# EAGLE design schema (EAGLE 6.5.0)
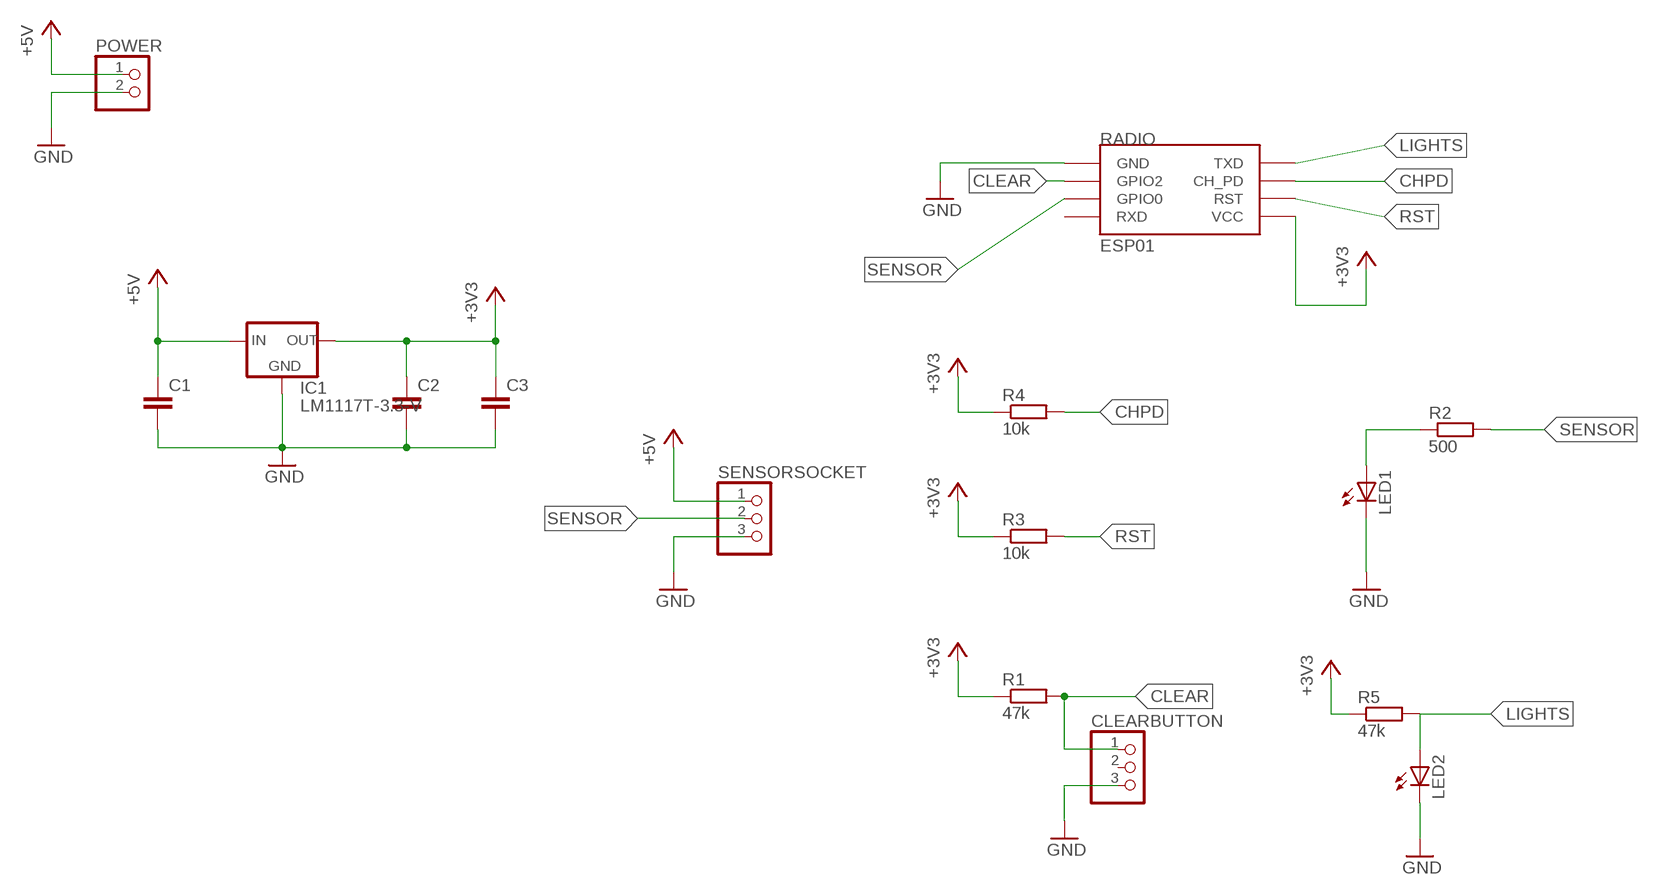
[diagram p0: schematic, sheet 1]

## Parts
C1  C-EU025-024X044  [C025-024X044]
C2  C-EU025-024X044  [C025-024X044]
C3  C-EU025-024X044  [C025-024X044]
CLEARBUTTON  PINHD-1X3  [1X03]
IC1  LM1117T-3.3-V  [TO220V]
LED1  LED3MM  [LED3MM]
LED2  LED3MM  [LED3MM]
POWER  PINHD-1X2  [1X02]
R1  47k  R-EU_0204/5  [0204/5]
R2  500  R-EU_0204/5  [0204/5]
R3  10k  R-EU_0204/5  [0204/5]
R4  10k  R-EU_0204/5  [0204/5]
R5  47k  R-EU_0204/5  [0204/5]
RADIO  ESP01  [ESP01]
SENSORSOCKET  PINHD-1X3  [1X03]

## Nets
+3V3: C2.1 C3.1 IC1.2(OUT) R1.1 R3.1 R4.1 R5.1 RADIO.VCC
+5V: C1.1 IC1.3(IN) POWER.1 SENSORSOCKET.1
CHPD: R4.2 RADIO.CH_PD
CLEAR: CLEARBUTTON.1 R1.2 RADIO.GPIO2
GND: C1.2 C2.2 C3.2 CLEARBUTTON.3 IC1.1(GND) LED1.K(C) LED2.K(C) POWER.2 RADIO.GND SENSORSOCKET.3
LIGHTS: LED2.A R5.2 RADIO.TX(TXD)
N$1: LED1.A R2.1
RST: R3.2 RADIO.RST
SENSOR: R2.2 RADIO.GPIO0 SENSORSOCKET.2
Unconnected: CLEARBUTTON.2 RADIO.RX(RXD)

## Library data of the parts
C1-C3 = rcl:C-EU: CAPACITOR, European symbol
CLEARBUTTON SENSORSOCKET = pinhead:PINHD-1X3: PIN HEADER
IC1 = lm1117:LM1117T-*
LED1 LED2 = led:LED: LED OSRAM: - CHIPLED LG R971, LG N971, LY N971, LG Q971, LY Q971, LO R971, LY R971 LH N974, LH R974 LS Q976, LO Q976, LY Q976 LO Q996 - Hyper CHIPLED LW Q18S LB Q993, LB Q99A, LB R99A - SideLED LS A670, LO A670, LY A670, LG A670, LP A670 LB A673, LV A673, LT A673, LW A673 LH A674 LY A675 LS A676, LA A676, LO A676, LY A676, LW A676 LS A679, LY A679, LG A679 - Hyper Micro SIDELED® LS Y876, LA Y876, LO Y876, LY Y876 LT Y87S - SmartLED LW L88C, LW L88S LB L89C, LB L89S, LG L890 LS L89K, LO L89K, LY L89K LS L896, LA L896, LO L896, LY L896 - TOPLED LS T670, LO T670, LY T670, LG T670, LP T670 LSG T670, LSP T670, LSY T670, LOP T670, LYG T670 LG T671, LOG T671, LSG T671 LB T673, LV T673, LT T673, LW T673 LH T674 LS T676, LA T676, LO T676, LY T676, LB T676, LH T676, LSB T676, LW T676 LB T67C, LV T67C, LT T67C, LS T67K, LO T67K, LY T67K, LW E67C LS E67B, LA E67B, LO E67B, LY E67B, LB E67C, LV E67C, LT E67C LW T67C LS T679, LY T679, LG T679 LS T770, LO T770, LY T770, LG T770, LP T770 LB T773, LV T773, LT T773, LW T773 LH T774 LS E675, LA E675, LY E675, LS T675 LS T776, LA T776, LO T776, LY T776, LB T776 LHGB T686 LT T68C, LB T68C - Hyper Mini TOPLED® LB M676 - Mini TOPLED Santana® LG M470 LS M47K, LO M47K, LY M47K Source: http://www.osram.convergy.de LUXEON: - LUMILED® LXK2-PW12-R00, LXK2-PW12-S00, LXK2-PW14-U00, LXK2-PW14-V00 LXK2-PM12-R00, LXK2-PM12-S00, LXK2-PM14-U00 LXK2-PE12-Q00, LXK2-PE12-R00, LXK2-PE12-S00, LXK2-PE14-T00, LXK2-PE14-U00 LXK2-PB12-K00, LXK2-PB12-L00, LXK2-PB12-M00, LXK2-PB14-N00, LXK2-PB14-P00, LXK2-PB14-Q00 LXK2-PR12-L00, LXK2-PR12-M00, LXK2-PR14-Q00, LXK2-PR14-R00 LXK2-PD12-Q00, LXK2-PD12-R00, LXK2-PD12-S00 LXK2-PH12-R00, LXK2-PH12-S00 LXK2-PL12-P00, LXK2-PL12-Q00, LXK2-PL12-R00 Source: www.luxeon.com KINGBRIGHT: KA-3528ASYC Source: www.kingbright.com
POWER = pinhead:PINHD-1X2: PIN HEADER
R1-R5 = rcl:R-EU_: RESISTOR, European symbol
RADIO = esp8266modules:ESP01: ESP8266 Wifi module 01

## Board
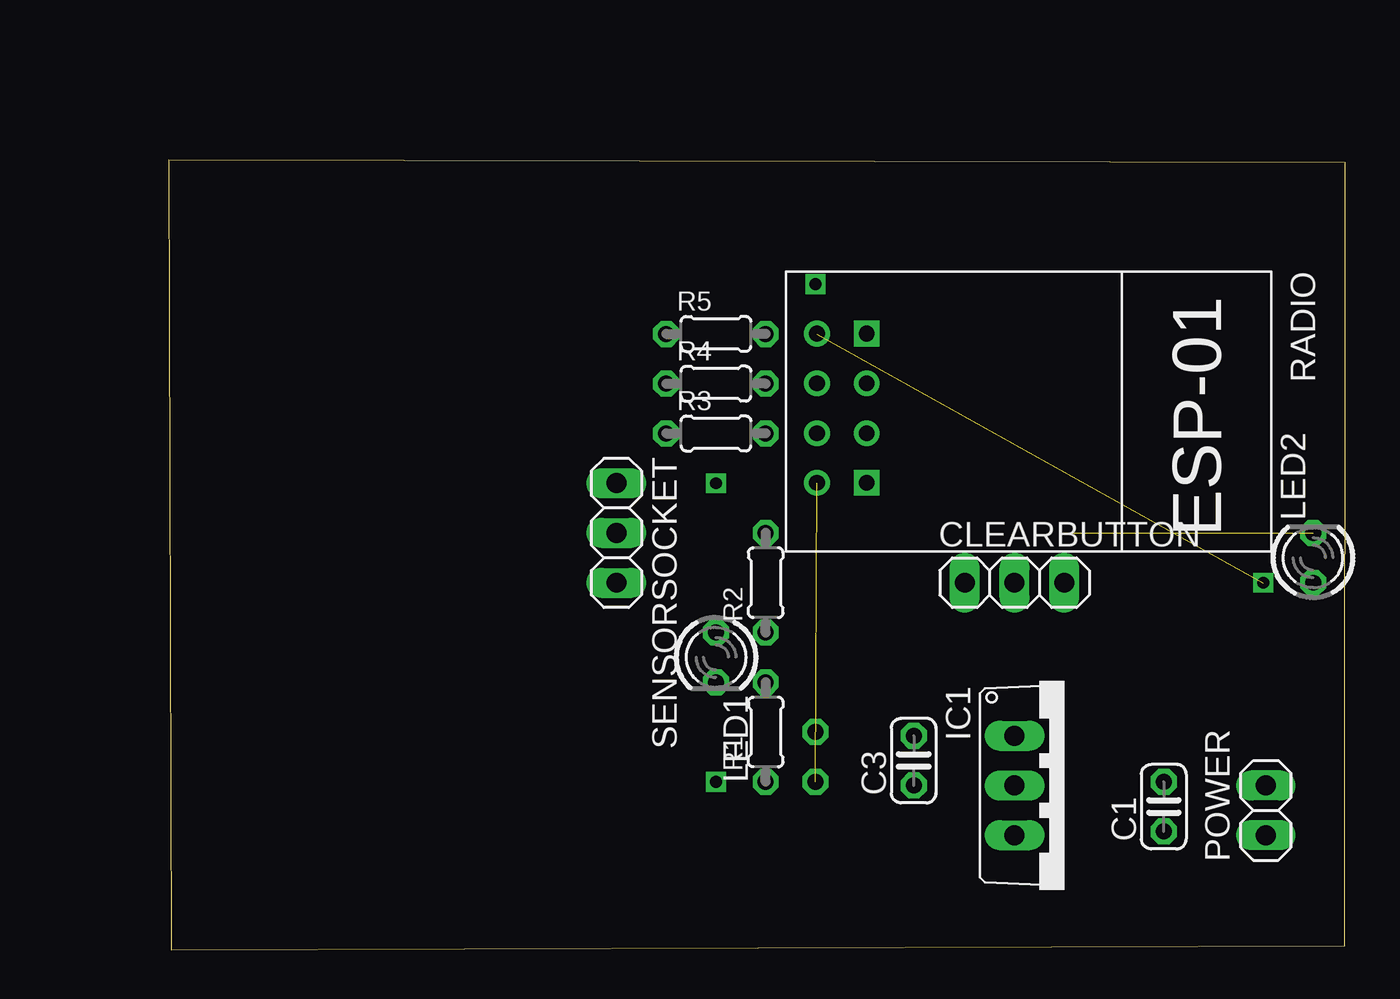
[diagram p1: board, top side]
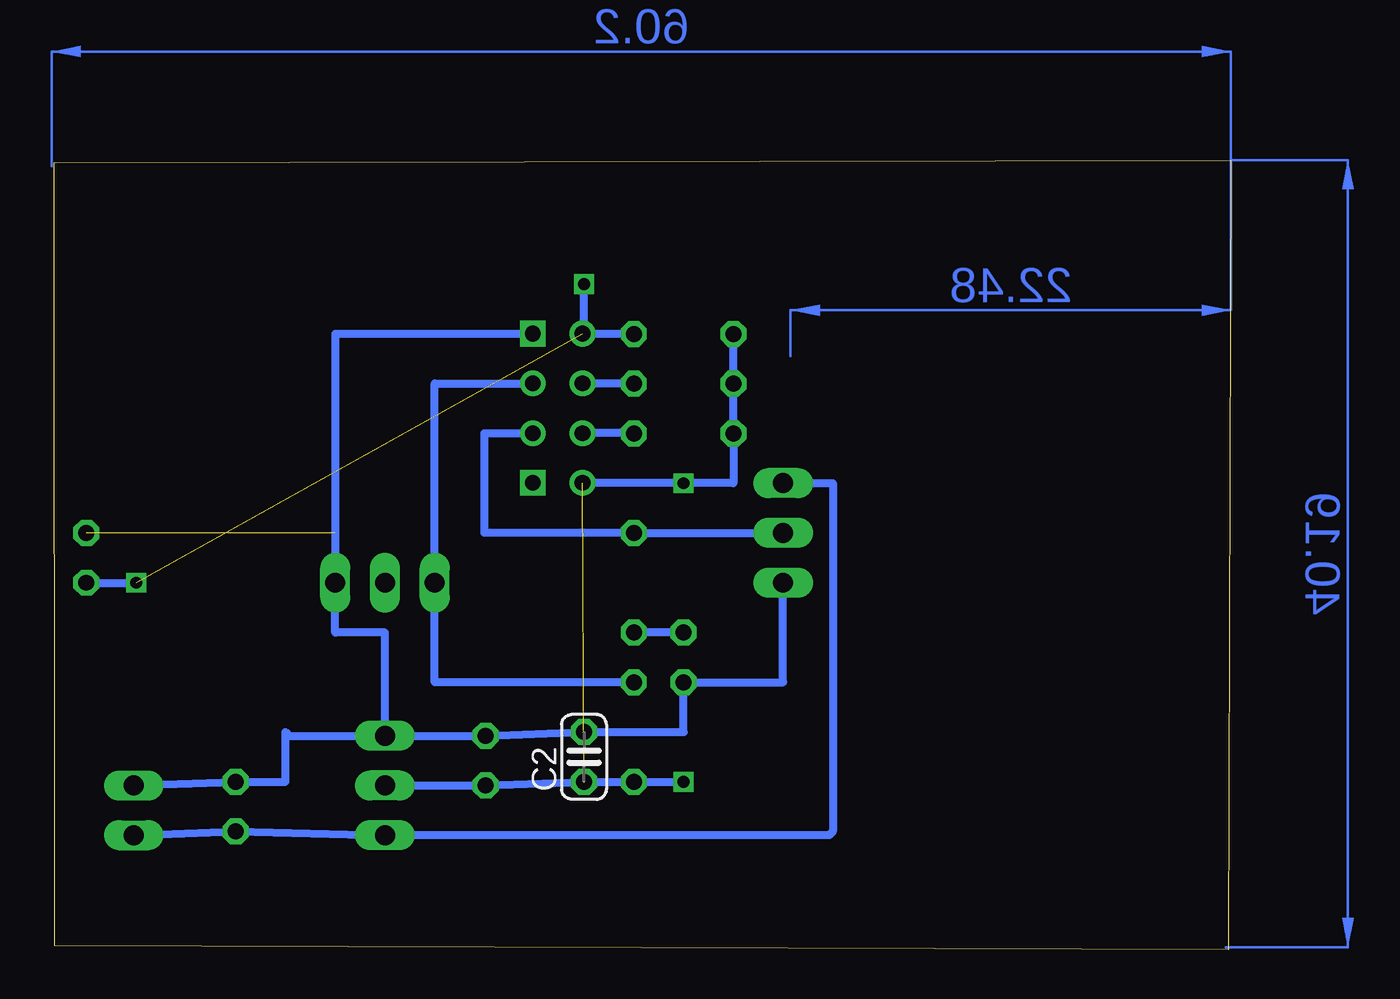
[diagram p2: board, bottom side, seen from below]

Size 60.06 x 40.31 mm. Coordinates in mm from the lower left corner, seen from the top.
Outline: 0.13,0 60.03,0.19 60.06,40.19 0,40.31 0.13,0
Copper layers (1*16): Top 0.035mm / dielectric 1.5mm / Bottom 0.035mm
Design rules "default": minimum track width 10mil, minimum drill 24mil, track to track 8mil, track to pad 8mil, pad to pad 8mil, via to via 8mil, smd to smd 8mil, copper to edge 40mil, drill to drill 8mil, minimum pad ring 10mil, minimum via ring 8mil, stop-mask expansion 4mil, vias tented up to drill 0mil, thermal gap 10mil

### Footprints (pad centres in the part's own frame; a part is rotated, then mirrored left to right if it is on the bottom)
C025-024X044 = drill 0.813 octagon: 1 -1.27,0; 2 1.27,0
1X03 = drill 1.016 long: 1 -2.54,0; 2 0,0; 3 2.54,0
TO220V = drill 1.016 long: 1 -2.54,-2.54; 2 0,-2.54; 3 2.54,-2.54
LED3MM = drill 0.813 octagon: A -1.27,0; K 1.27,0
1X02 = drill 1.016 long: 1 -1.27,0; 2 1.27,0
0204/5 = drill 0.813 octagon: 1 -2.54,0; 2 2.54,0
ESP01 = drill 0.8: CH_PD -1.285,-8.178; GPIO0 1.255,-5.638; GPIO2 -1.285,-5.638; RST 1.255,-8.178; TX -3.825,-8.178; VCC 3.795,-8.178 | drill 0.8 square: GND -3.825,-5.638; RX 3.795,-5.638

### Placement (x,y rotation side)
C1  50.8,7.3 90 top
C2  33.02,9.84 90 bottom
C3  38.04,9.65 90 top
CLEARBUTTON  43.18,18.73 0 top
IC1  45.72,8.38 270 top
LED1  27.94,14.92 270 top
LED2  58.42,20 90 top
POWER  56.01,7.11 90 top
R1  30.48,11.11 90 top
R2  30.48,18.73 90 top
R3  27.94,26.35 0 top
R4  27.94,28.89 0 top
R5  27.94,31.43 0 top
RADIO  41.27,27.62 270 top
SENSORSOCKET  22.86,21.27 270 top

### Tracks (layer width: path | path; a pad name or v marks a point on that pad's centre or on a via)
+3V3  (1 unrouted)
  Bottom 0.406: IC1.2 C3.1 C2.1 | C2.1 R1.1 | RADIO.VCC 25.41,23.83 25.4,23.81 R3.1 R4.1 R5.1 | C2.1 27.94,8.57
+5V
  Bottom 0.406: POWER.1 C1.1 IC1.3 20.51,5.84 20.32,6.03 20.32,23.81 SENSORSOCKET.1
CHPD
  Bottom 0.406: R4.2 30.5,28.91 RADIO.CH_PD
CLEAR
  Bottom 0.406: RADIO.GPIO2 40.62,28.91 40.64,28.89 CLEARBUTTON.1 40.64,13.65 R1.2
GND  (1 unrouted)
  Bottom 0.406: POWER.2 C1.2 48.26,8.57 48.26,11.11 48.07,10.92 IC1.1 | IC1.1 C3.2 C2.2 27.94,11.11 LED1.K 22.86,13.65 SENSORSOCKET.3 | RADIO.GND 35.65,31.43 45.72,31.43 45.72,21.27 CLEARBUTTON.3 45.72,16.19 43.18,16.19 IC1.1
LIGHTS  (1 unrouted)
  Bottom 0.406: R5.2 33.1,31.43 RADIO.TX 33.02,31.45 33.02,33.97 | LED2.A 55.88,18.73
N$1
  Bottom 0.406: LED1.A R2.1
N$4  (via drill 0.6)
  other vias: 27.94,23.81
N$5  (via drill 0.6)
  other vias: 27.94,8.57
N$6  (via drill 0.6)
  other vias: 33.02,33.97
N$7  (via drill 0.6)
  other vias: 55.88,18.73
RST
  Bottom 0.406: R3.2 30.5,26.37 RADIO.RST
SENSOR
  Bottom 0.406: SENSORSOCKET.2 R2.2 38.1,21.27 38.1,26.35 38.09,26.37 RADIO.GPIO0
(copper drawn outside any net)
  shapes: Bottom area x3